# Altium schematic sheet Top sheet.SchDoc: Top Sheet
size A; DocumentNumber: 1; SheetNumber: 1; SheetTotal: 6; SPICEModelCachePVRFRYQE: <root> / <DocumentId>PVRFRYQE</DocumentId> / </root>
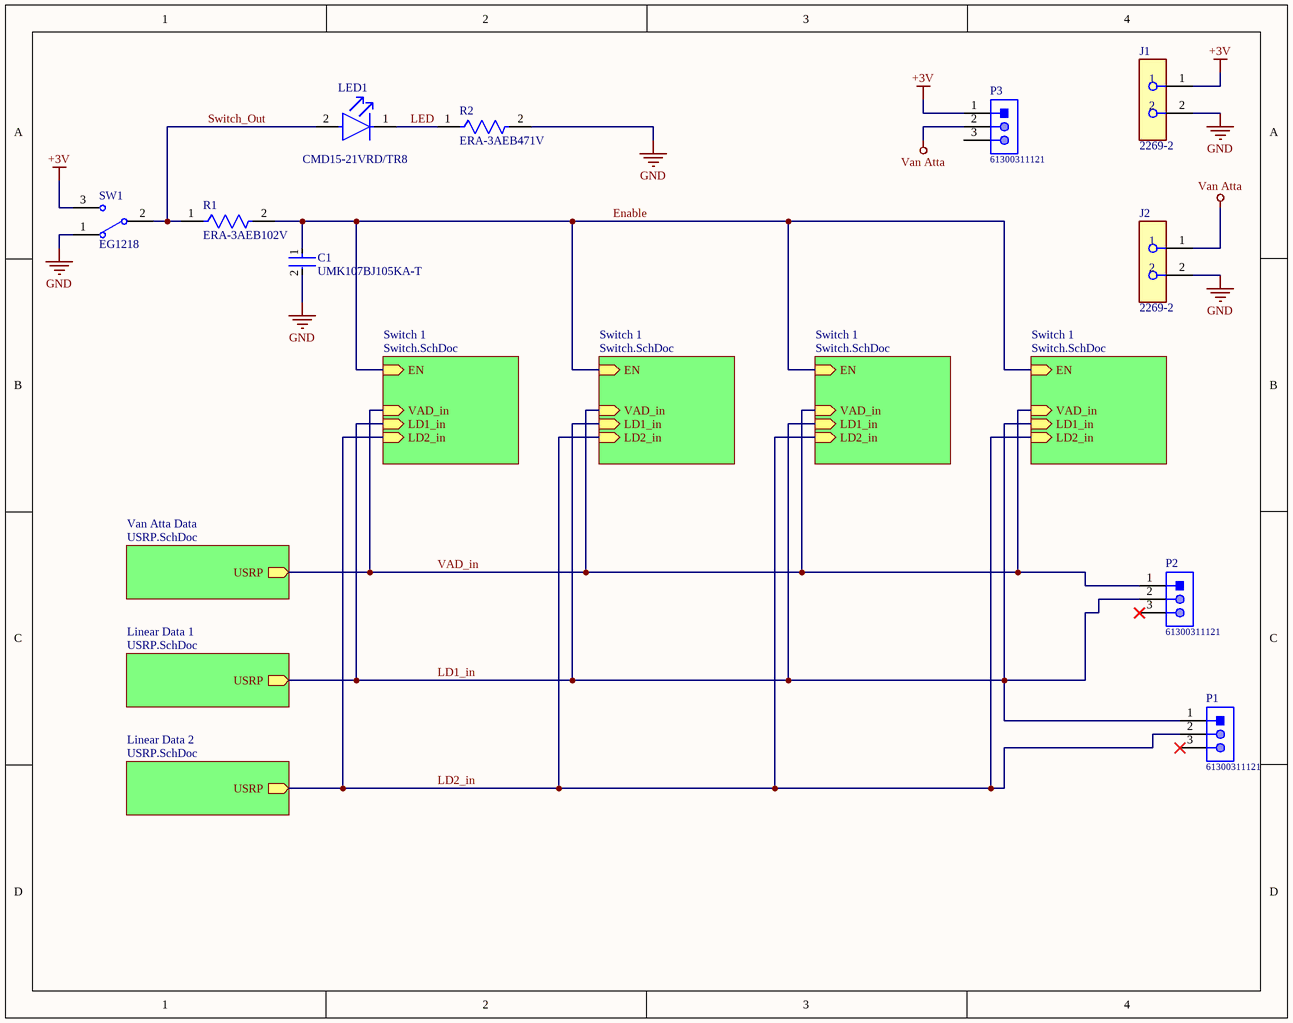
[diagram p0: Top sheet.SchDoc]

## Parts
C1  UMK107BJ105KA-T  [FP-0603-L_1_6_0_1-W_0_8_0-IPC_A]
J1  2269-2  [FP-2269-2-MFG]
J2  2269-2  [FP-2269-2-MFG]
LED1  CMD15-21VRD/TR8  [FP-CMD15-21-MFG]
P1  61300311121  [61300311121]
P2  61300311121  [61300311121]
P3  61300311121  [61300311121]
R1  ERA-3AEB102V  [FP-ERA3A-IPC_C]
R2  ERA-3AEB471V  [FP-ERA3A-IPC_A]
SW1  EG1218  [ESWI-EG1218_V]

## Sub-sheets
Linear Data 1 = USRP.SchDoc: USRP (out)
Linear Data 2 = USRP.SchDoc: USRP (out)
Switch 1 = Switch.SchDoc: EN (in), LD2_in (in), LD1_in (in), VAD_in (in)
Switch 1 = Switch.SchDoc: EN (in), LD2_in (in), LD1_in (in), VAD_in (in)
Switch 1 = Switch.SchDoc: EN (in), LD2_in (in), LD1_in (in), VAD_in (in)
Switch 1 = Switch.SchDoc: EN (in), LD2_in (in), LD1_in (in), VAD_in (in)
Van Atta Data = USRP.SchDoc: USRP (out)

## Nets
+3V: J1.1 P3.1 SW1.3
GND: C1.2 J1.2 J2.2 R2.2 SW1.1
Van Atta: J2.1 P3.2
Enable: C1.1 R1.2 ; sheet Switch 1/EN, sheet Switch 1/EN, sheet Switch 1/EN, sheet Switch 1/EN
LD1_in: P1.1 P2.2 ; sheet Switch 1/LD1_in, sheet Linear Data 1/USRP, sheet Switch 1/LD1_in, sheet Switch 1/LD1_in, sheet Switch 1/LD1_in
LD2_in: P1.2 ; sheet Switch 1/LD2_in, sheet Linear Data 2/USRP, sheet Switch 1/LD2_in, sheet Switch 1/LD2_in, sheet Switch 1/LD2_in
LED: LED1.1(C) R2.1
Switch_Out: LED1.2(A) R1.1 SW1.2(COM)
VAD_in: P2.1 ; sheet Switch 1/VAD_in, sheet Van Atta Data/USRP, sheet Switch 1/VAD_in, sheet Switch 1/VAD_in, sheet Switch 1/VAD_in

Not connected (* = marked no-connect by the designer): P1 3*; P2 3*; P3 3

## Library data of the parts
C1 = CMP-2000-05447-3: None; Tolerance: 10%; Voltage Rating: 50V; Capacitance: 1uF; Dielectric: X5R; Height: 0.8mm; Depth: 0.8mm; Number of Pins: 2; Length: 1.6mm; Thickness: 0.035inch; Contact Plating: Nickel; Radiation Hardening: No; Package Quantity: 1; Case/Package: 0603; Halogen Free: Halogen Free; RoHS Compliant: Yes; Termination: SMD/SMT; Max Operating Temperature: 85°C; Min Operating Temperature: -55°C; Case Code (Metric): 1608; Construction: Flat; Voltage Rating (DC): 50V; Packaging: Tape and Reel; Series: M; Case Code (Imperial): 0603; Width: 0.031inch; Mount: Surface Mount
J1 J2 = CMP-73906-000010-1: CONN DBL BANANA JACK TURRET; Voltage Rating (DC): 70V; Max Current Rating: 15A; Number of Contacts: 2; Voltage Rating: 2.5kV; Body Material: PC; Gender: Female; Insulation: Mating End Insulated; Housing Color: Red; Insulation Material: Polycarbonate; Contact Material: Brass; Termination: Solder; Height: 0.375inch; Orientation: Straight; Lead Free: Lead Free; Length: 24inch; Depth: 16mm; Current Rating: 15A; Width: 4inch; Contact Plating: Tin; Weight: 0.033lb; RoHS Compliant: Yes; REACH SVHC: No SVHC; Package Quantity: 5; Number of Ports: 2; Color: Red; Housing Material: Polycarbonate; Packaging: Bulk; Mount: Panel
LED1 = CMP-53976-000002-1: LED RED DIFFUSED 1206 SMD; Manufacturer: VCC; Led Orientation: Top View; Peak Emmision Wavelength: 640nm; Forward Current: 20mA; Power Dissipation: 105mW; Luminous Intensity: 4mcd; Forward Voltage: 2V; Reverse Voltage: 5V; Lead Free: Yes; Device Class L1: Optoelectronics; Package: CMD15-21; Temperature Range High: +85°C; Digikey Description: LED RED DIFFUSED 1206 SMD; Mouser Description: Standard LEDs - SMD RED DIFFUSED; Height: 1.3mm; ComponentLink2Description: Datasheet; Manufacturer Part Number: CMD15-21VRD/TR8; ComponentLink2URL: https://www.vcclite.com/wp-content/uploads/wpallimport/files/files/CMD1521SeriesRev1.pdf; Temperature: -40°C to +85°C; Automotive: No; Octopart: https://octopart.com/cmd15-21vrd%2Ftr8-vcc-26668835; Temperature Range Low: -40°C; Device Class L3: unset; Colour: Red; Category: Diode; Device Class L2: LEDs; RoHS: TRUE
P1-P3 = CMP-1502-01062-1: THT Vertical Pin Header WR-PHD, Pitch 2.54 mm, Single Row, 3 pins; Manufacturer: Wurth Elektronik; Withstanding Voltage: 500VAC; Working Voltage: 250VAC; Rated Current: 3A; Pitch: 2.54mm; Pin Number: 3; Gender: Male; Contact Resistance: 20mOhm; Package Reference: 61300311121; Manufacturer URL: http://www.we-online.de; Datasheet URL: https://katalog.we-online.de/em/datasheet/6130xx11121.pdf; Operating Temperature: -40to105degC; Part Number: 61300311121; Orientation: Vertical; Packaging: Bag; Row Number: Single; Mounting Technology: THT; Publisher: WurthElektronik
R1 = CMP-2000-00873-2: RES SMD 1K OHM 0.1% 1/10W 0603; Temperature Coefficient: 25ppm/°C; Voltage Rating: 75V; Max Power Dissipation: 100mW; Resistance: 1kR; Technology: METAL FILM; Number of Pins: 2; Packaging: Tape and Reel; Case Code (Imperial): 0603; Case Code (Metric): 1608; Min Operating Temperature: -55°C; REACH SVHC: No SVHC; Length: 1.6mm; Termination: SMD/SMT; Depth: 0.8mm; Resistance Tolerance: 0.1%; Number of Terminations: 2; Width: 0.8mm; Military Standard: Not; Tolerance: 0.1%; Package Quantity: 5000; Contact Plating: Tin; Height: 0.45mm; Construction: Rectangular; Case/Package: 0603; Max Operating Temperature: 155°C; Resistor Type: Thin Film; Series: ERA-3A; Size Code: 0603; RoHS Compliant: Yes; Mount: Surface Mount; Radiation Hardening: No; Power Rating: 100mW
R2 = CMP-2000-00071-2: RES SMD 470 OHM 0.1% 1/10W 0603; Temperature Coefficient: 25ppm/°C; Power Rating: 100mW; Voltage Rating: 75V; Resistance: 470R; Mount: Surface Mount; Size Code: 0603; Contact Plating: Tin; Military Standard: Not; Resistor Type: Thin Film; Width: 0.8mm; Length: 1.6mm; Technology: THIN FILM; RoHS Compliant: Yes; Number of Terminations: 2; Series: ERA-3A; Number of Pins: 2; Construction: Rectangular; Radiation Hardening: No; Max Operating Temperature: 155°C; Termination: SMD/SMT; Case Code (Imperial): 0603; Case Code (Metric): 1608; Tolerance: 0.1%; Packaging: Tape and Reel; Depth: 0.8mm; REACH SVHC: No SVHC; Case/Package: 0603; Min Operating Temperature: -55°C; Lead Free: Lead Free; Package Quantity: 1; Resistance Tolerance: 0.1%; Voltage Rating (DC): 75V; Max Power Dissipation: 100mW; Features: Automotive AEC-Q200; Height: 0.45mm
SW1 = CMP-011-00006-2: Slide Switch, SPDT, 500 V, -20 to 70 degC, 3-Pin THD, RoHS, Bulk; Manufacturer: E-Switch; Voltage Rating (DC): 30V; Current Rating: 200mA; Operating Force: 250gf; Package Quantity: 1000; Contact Plating: Silver; Max Operating Temperature: 70°C; Min Operating Temperature: -20°C; Contact Material: Copper; Datasheet URL: https://www.e-switch.com/system/asset/product_line/data_sheet/119/EG.pdf; Contact Finish: Silver; Case/Package: EG1218; Voltage Rating (AC): 30V; Datasheet Version: Oct-15; Package Description: 3-Pin Through Hole Device, Body 11.6 x 4 mm, Pitch 2.5 mm; RoHS Compliant: True; Package Reference: EG1218; Manufacturer URL: http://www.e-switch.ch/en/; Throw Configuration: SPDT; Contact Current Rating: 200mA; Mounting Technology: TH; Packaging: Bulk; Pins: 3